# Altium schematic sheet PWR_PROT.SchDoc
size B; SheetNumber: 3; SheetTotal: 9
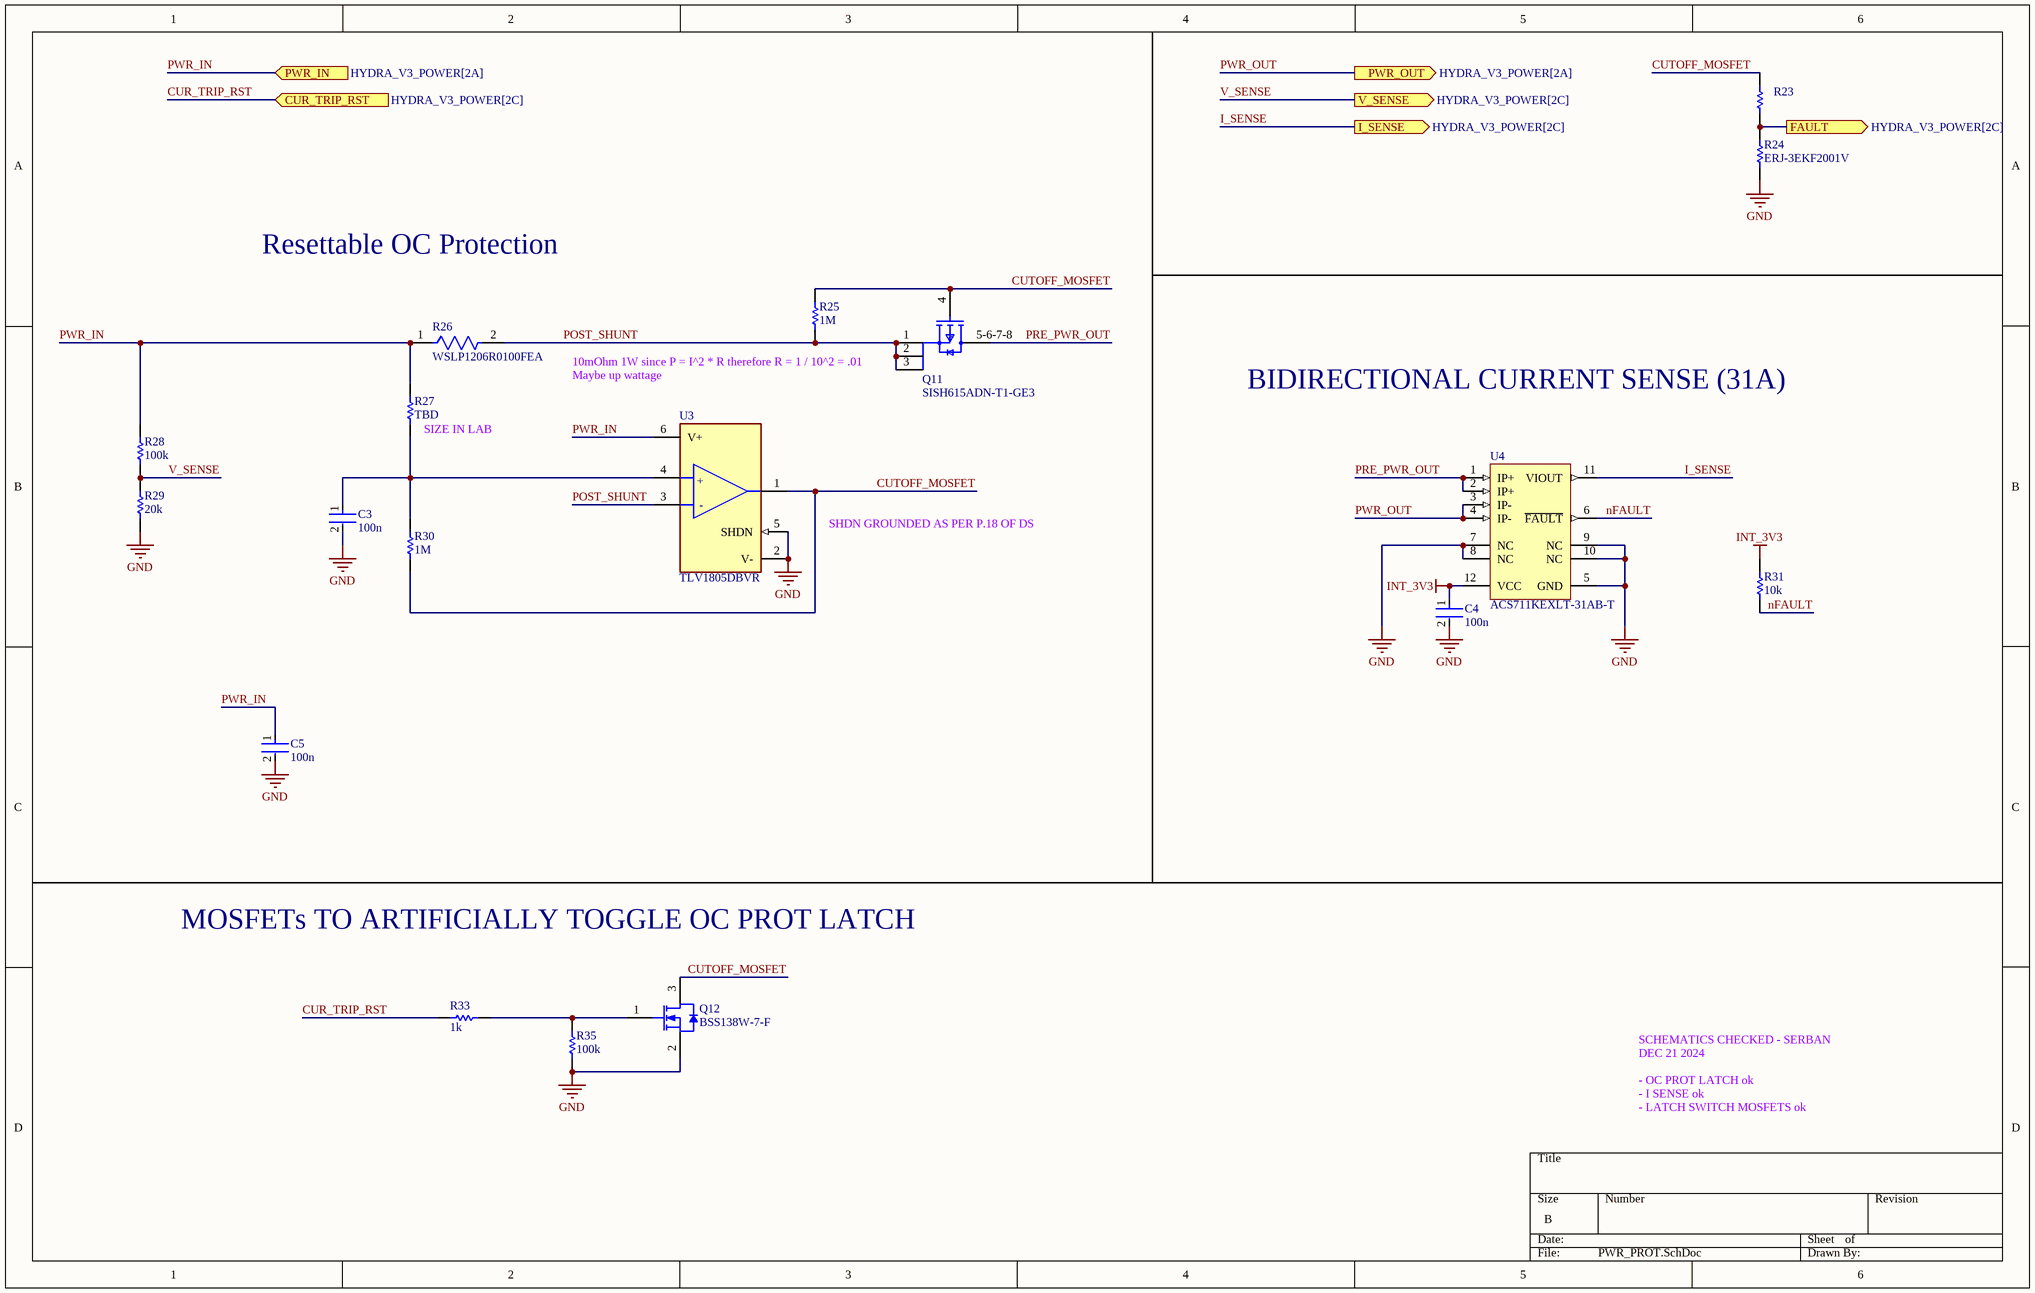
[diagram p0: PWR_PROT.SchDoc]

## Parts
C3  100n  [FP-0402-L_1_0_0_05-W_0_5-IPC_A]
C4  100n  [FP-0402-L_1_0_0_05-W_0_5-IPC_A]
C5  100n  [FP-0402-L_1_0_0_05-W_0_5-IPC_A]
Q11  SISH615ADN-T1-GE3  [SISH615ADN-T1-GE3-Footprint-1]
Q12  BSS138W-7-F  [DIOD-SOT323-3_V]
R23  ERJ3EKF1002V  [RESC1609X55X30LL15T15]  (value not drawn)
R24  ERJ-3EKF2001V  [RESC1608X55X30ML15T15]
R25  1M  [R0603B]
R26  WSLP1206R0100FEA  [FP-WSLP1206-FP_1_65x1_93x-MFG]
R27  TBD  [R0603B]
R28  100k  [R0603B]
R29  20k  [R0603B]
R30  1M  [R0603B]
R31  10k  [R0603B]
R33  1k  [R0603B]
R35  100k  [R0603B]
U3  TLV1805DBVR  [FP-DBV0006A-IPC_C]
U4  ACS711KEXLT-31AB-T  [ALEG-EX-12_V]

## Ports
CUR_TRIP_RST (in, see HYDRA_V3_POWER[2C]), FAULT (out, see HYDRA_V3_POWER[2C]), I_SENSE (out, see HYDRA_V3_POWER[2C]), PWR_IN (in, see HYDRA_V3_POWER[2A]), PWR_OUT (out, see HYDRA_V3_POWER[2A]), V_SENSE (out, see HYDRA_V3_POWER[2C])

## Nets
GND: C3.2 C4.2 C5.2 Q12.2(S) R24.1 R29.1 R35.1 U3.2(V-) U3.5(SHDN) U4.5(GND) U4.7(NC) U4.8(NC) U4.9(NC) U4.10(NC)
INT_3V3: C4.1 R31.2 U4.12(VCC)
CUR_TRIP_RST: R33.2 ; port CUR_TRIP_RST
CUTOFF_MOSFET: Q11.4(G) Q12.3(D) R23.1 R25.2 R30.1 U3.1(OUT)
FAULT: R23.2 R24.2 ; port FAULT
I_SENSE: U4.11(VIOUT) ; port I_SENSE
nFAULT: R31.1 U4.6(~{FAULT})
POST_SHUNT: Q11.1(S) Q11.2(S) Q11.3(S) R25.1 R26.2 U3.3(-IN)
PRE_PWR_OUT: Q11.5-6-7-8(D) U4.1(IP+) U4.2(IP+)
PWR_IN: C5.1 R26.1 R27.2 R28.2 U3.6(V+) ; port PWR_IN
PWR_OUT: U4.3(IP-) U4.4(IP-) ; port PWR_OUT
V_SENSE: R28.1 R29.2 ; port V_SENSE
NetC3_1: C3.1 R27.1 R30.2 U3.4(+IN)
NetQ12_1: Q12.1(G) R33.1 R35.2

## Notes on the sheet
- Resettable OC Protection
- (near Q11) 10mOhm 1W since P = I^2 * R therefore R = 1 / 10^2 = .01
- (near R27) SIZE IN LAB
- Maybe up wattage
- BIDIRECTIONAL CURRENT SENSE (31A)
- SHDN GROUNDED AS PER P.18 OF DS
- MOSFETs TO ARTIFICIALLY TOGGLE OC PROT LATCH
- SCHEMATICS CHECKED - SERBAN
  DEC 21 2024
  - OC PROT LATCH ok
  - I SENSE ok
  - LATCH SWITCH MOSFETS ok
- (in symbol CMP-04896-000098-1) +; -

## Library data of the parts
C3-C5 = CMP-001-00058-1: LARGE PADS, 0402 CAP, CHANGE COMMENT TO MATCH REAL P/N; Capacitor Type: Ceramic; Min Operating Temperature: -55°C; Mounting Technology: Surface Mount; Pins: 2; Case/Package: 0402; RoHS Compliant: Yes; Max Operating Temperature: 85°C
Q11 = CMP-013-00018-2: Trans MOSFET P-CH 20V 22.1A 8-Pin PowerPAK 1212 EP T/R; Source: SISH615ADN-T1-GE3.SchLib; Design Item ID: CMP-013-00036-4; Component Type: Standard; Pins: 5
Q12 = CMP-2000-05968-1: N-Channel Enhancement Mode Mosfet, 50 V, 200 mA, -55 to 150 degC, 6-Pin SOT-323, RoHS, Tape and Reel; Typical Turn-Off Delay Time: 20ns; Number of Channels: 1Channel; Type: EnhancementModeFieldEffectTransistor; Brand: DiodesIncorporated; Vds - Drain-Source Breakdown Voltage: 75V; Vgs - Gate-Source Voltage: 20V; Rds On - Drain-Source Resistance: 1.4Ohms; Transistor Type: 1N-Channel; Configuration: Single; Unit Weight: 0.000212oz; Pd - Power Dissipation: 200mW; Id - Continuous Drain Current: 200mA; Forward Transconductance - Min: 0.1S; Manufacturer URL: http://www.diodes.com/; Series: BSS138; Package Description: 3-Pin Small Outline Transistor, Body 2 x 1.25 mm, Pitch 0.65 mm; Mounting Technology: SurfaceMount; Product Category: MOSFET; RoHS: True; Maximum Operating Temperature: +150C; Height: 1mm; Length: 2.2mm; Technology: Si; Width: 1.35mm; Datasheet URL: http://www.diodes.com/_files/datasheets/ds30206.pdf; Manufacturer: DiodesIncorporated; Package / Case: SOT-323-3; Typical Turn-On Delay Time: 20ns; Transistor Polarity: N-Channel; Factory Pack Quantity: 3000; Packaging: Reel; Product: MOSFETSmallSignal; Datasheet Version: Rev. 11-2, 09/2013; Package Reference: SOT323; Minimum Operating Temperature: -55C; Mounting Style: SMD/SMT; Channel Mode: Enhancement
R23 = CMP-1012-00623-3: Chip Resistor, 10 KOhm, +/- 1%, 0.1 W, -55 to 155 degC, 0603 (1608 Metric), RoHS, Tape and Reel; Manufacturer: Panasonic; Voltage Rating: 75V; Case\/Package: 0603; Power Rating: 100mW; Resistance: 10KOhm; Temperature Coefficient: 100ppm\/degreesC; Number of Pins: 2; Package Reference: 603; Depth: 0.8mm; Mount: SurfaceMount; Package Description: 2-Pin Surface Mount Device, Body 1.6 x 0.85 mm; Datasheet Version: 02/2017; Length: 1.6mm; Lead Free: LeadFree; Height: 0.45mm; Number of Terminations: 2; Max Power Dissipation: 100mW; Min Operating Temperature: -55degC; Datasheet URL: https://industrial.panasonic.com/cdbs/www-data/pdf/RDA0000/AOA0000C304.pdf; Termination: SMD/SMT; Case Code (Metric): 1608; Case Code (Imperial): 0603; Tolerance: 1%; Max Operating Temperature: 155degC; RoHSCompliant: true; Voltage Rating (DC): 75V; Radiation Hardening: No; Packaging: TapeandReel; Composition: ThickFilm; Mounting Technology: SurfaceMount; Manufacturer URL: http://www.panasonic.com/; Width: 0.031inch; REACH SVHC: NoSVHC; Contact Plating: Tin; Military Standard: Not; Package Quantity: 1
R24 = CMP-2000-00317-1: Manufacturer: Panasonic; Part Number: ERJ-3EKF2001V
R25 R27-R31 R33 R35 = CMP-009-00002-14: Resistor
R26 = CMP-2003-04373-2: RES 0.01 OHM 1% 1W 1206; Temperature Coefficient: 75ppm/°C; Resistance: 10mR; Features: Moisture Resistant; Case/Package: 1206; Military Standard: Not; Case Code (Imperial): 1206; Power Rating: 1W; Number of Terminations: 2; Lead Free: Lead Free; Number of Pins: 2; Min Operating Temperature: -65°C; Weight: 0.000571oz; Radiation Hardening: No; Series: WSLP; Length: 3.2mm; Termination: SMD/SMT; Mount: Surface Mount; Size Code: 1206; Height: 0.035inch; Case Code (Metric): 3216; Resistance Tolerance: 1%; Contact Plating: Tin; Width: 0.063inch; Construction: Rectangular; Packaging: Tape and Reel; Package Quantity: 1; RoHS Compliant: Yes; Depth: 1.6mm; Tolerance: 1%; Max Operating Temperature: 170°C; Max Power Dissipation: 1W; Resistor Type: Metal Strip
U3 = CMP-04896-000098-1: 40V, RAIL-TO-RAIL INPUT, PUSH-PU
U4 = CMP-1557-00002-1: Hall Effect Linear Current Sensor with Overcurrent Fault Output for <100 V Isolation Applications, 3 to 5.5 V, -31 to 31 A IP, -40 to 125 degC, 12-Pin QFN (EX), RoHS, Tape and Reel; IP Max: 31 A; VCC Min: 3 V; -3dB Bandwidth: 0.1 MHz; VCC Max: 5.5 V; IP Min: -31 A; Mounting Technology: Surface Mount; DatasheetVersion: Rev. 3; Temperature Min: -40 degC; ComponentLink1Description: Manufacturer URL; Packing: Tape and Reel; PartNumber: ACS711KEXLT-31AB-T; Temperature Max: 125 degC; ComponentLink2Description: Datasheet; ComponentLink3Description: Package Specification; RoHS: TRUE; ComponentLink1URL: http://www.allegromicro.com/; ComponentLink2URL: http://www.allegromicro.com/~/media/Files/Datasheets/ACS711-Datasheet.ashx?la=en; PackageDescription: 12-Pin Quad Flat No-Lead, Body 3 x 3 mm, Height 0.8 mm; ComponentLink3URL: http://www.allegromicro.com/~/media/Files/Datasheets/ACS711-Datasheet.ashx?la=en